# Altium schematic sheet display.SchDoc
size A
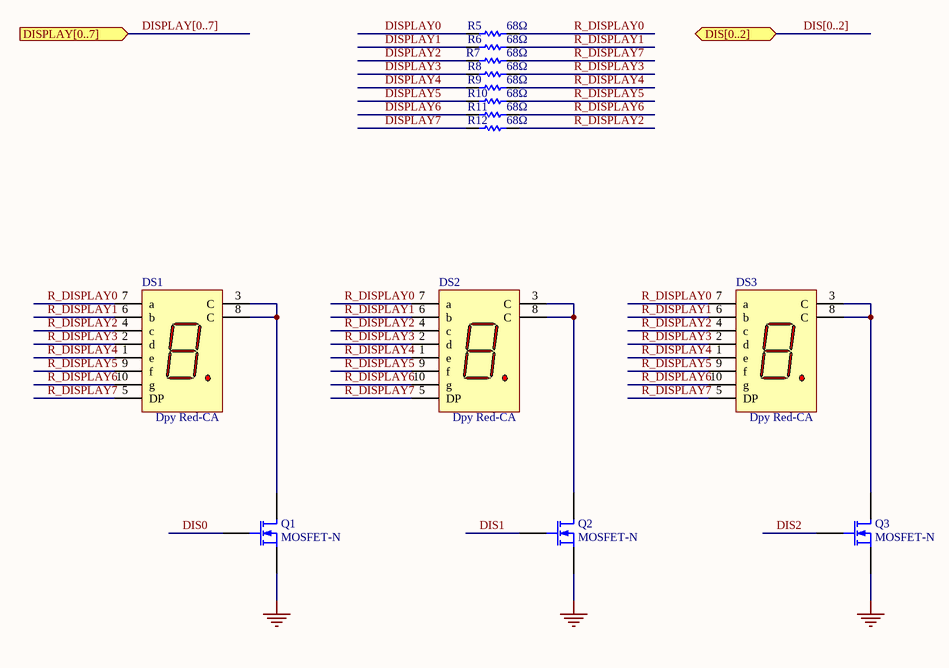
[diagram p0: display.SchDoc]

## Parts
DS1  Dpy Red-CA  [DISPLAY]
DS2  Dpy Red-CA  [DISPLAY]
DS3  Dpy Red-CA  [DISPLAY]
Q1  MOSFET-N  [MOSFET]
Q2  MOSFET-N  [MOSFET]
Q3  MOSFET-N  [MOSFET]
R5  value 68Ω  [RESISTANCE]  (hidden comment: Res1)
R6  value 68Ω  [RESISTANCE]  (hidden comment: Res1)
R7  value 68Ω  [RESISTANCE]  (hidden comment: Res1)
R8  value 68Ω  [RESISTANCE]  (hidden comment: Res1)
R9  value 68Ω  [RESISTANCE]  (hidden comment: Res1)
R10  value 68Ω  [RESISTANCE]  (hidden comment: Res1)
R11  value 68Ω  [RESISTANCE]  (hidden comment: Res1)
R12  value 68Ω  [RESISTANCE]  (hidden comment: Res1)

## Ports
DIS[0..2] (bidir), DISPLAY[0..7] (in)

## Nets
GND: Q1.3(D) Q2.3(S) Q3.3(S)
DIS0: Q1.2(S)
DIS1: Q2.2(G)
DIS2: Q3.2(G)
DISPLAY0: R5.1
DISPLAY1: R6.1
DISPLAY2: R7.1
DISPLAY3: R8.1
DISPLAY4: R9.1
DISPLAY5: R10.1
DISPLAY6: R11.1
DISPLAY7: R12.1
R_DISPLAY0: DS1.7(a) DS2.7(a) DS3.7(a) R5.2
R_DISPLAY1: DS1.6(b) DS2.6(b) DS3.6(b) R6.2
R_DISPLAY2: DS1.4(c) DS2.4(c) DS3.4(c) R12.2
R_DISPLAY3: DS1.2(d) DS2.2(d) DS3.2(d) R8.2
R_DISPLAY4: DS1.1(e) DS2.1(e) DS3.1(e) R9.2
R_DISPLAY5: DS1.9(f) DS2.9(f) DS3.9(f) R10.2
R_DISPLAY6: DS1.10(g) DS2.10(g) DS3.10(g) R11.2
R_DISPLAY7: DS1.5(DP) DS2.5(DP) DS3.5(DP) R7.2
NetDS1_3: DS1.3(C) DS1.8(C) Q1.1(G)
NetDS2_3: DS2.3(C) DS2.8(C) Q2.1(D)
NetDS3_3: DS3.3(C) DS3.8(C) Q3.1(D)

## Buses and harness runs
bus DIS[0..2] = port DIS[0..2]
bus DISPLAY[0..7] = port DISPLAY[0..7]

## Library data of the parts
DS1-DS3 = Dpy Red-CA: Afficheur 7-Segment; MinimumIntensity: 360 ucd; Note: IF = 5 mA; Colour: High Efficiency Red (HER); Note: Pins 1 and 6 are redundant Anodes.; Fabricant: KINGBRIGHT; Ref. fabricant: SC56-11EWA; Ref. fournisseur: 1142441; Fournisseur: Farnell; Published: 8-Jun-2000; LatestRevisionDate: 17-Dec-2003; LatestRevisionNote: Schematic revised, PCB Footprint replaced.; DatasheetVersion: 19-Feb-2002; PackageVersion: 11-Feb-2002; PackageReference: A; Publisher: Altium Limited; PackageDescription: LED, 7-Segment Display, 7.62 mm, RHD; 10 Leads; Row Space 5.08 mm; Pitch 2.54 mm; ComponentLink1Description: Manufacturer Link; ComponentLink1URL: http://www.agilent.com/
Q1-Q3 = MOSFET-N: N-Channel MOSFET; Fabricant: NXP; Ref. fabricant: 2N7002PW; Fournisseur: Farnell; Ref. fournisseur: 1829184; Published: 8-Jun-2000; LatestRevisionDate: 17-Jul-2002; LatestRevisionNote: Re-released for DXP Platform.; PackageVersion: 1995/1996; PackageReference: E3; Publisher: Altium Limited; PackageDescription: TO, Flat Index; 3 In-Line, Axial Leads; Body Dia. 4.6mm; Lead Dia. 0.5 mm (max)
R5-R12 = Res1: Resistor; Published: 8-Jun-2000; LatestRevisionDate: 17-Jul-2002; LatestRevisionNote: Re-released for DXP Platform.; PackageReference: AXIAL-0.3; Publisher: Altium Limited; PackageDescription: Axial Device, Thru-Hole; 2 Leads; 0.3 in Pin Spacing